# EAGLE design SENSORVALVULAF (EAGLE 9.6.2)
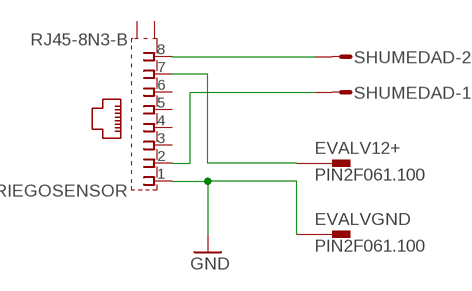
[diagram p0: schematic, sheet 1]

## Parts
EVALV12+  PIN2F061.100  [F061.100]
EVALVGND  PIN2F061.100  [F061.100]
RIEGOSENSOR  RJ45-8N3-B  [TE_RJ45-8N3-B]
SHUMEDAD  L02P  [L02P]

## Nets
GND: EVALVGND.A1 EVALVGND.A2 RIEGOSENSOR.1
N$1: RIEGOSENSOR.8 SHUMEDAD.2
N$2: RIEGOSENSOR.2 SHUMEDAD.1
N$3: EVALV12+.A1 EVALV12+.A2 RIEGOSENSOR.7
Unconnected: RIEGOSENSOR.3 RIEGOSENSOR.4 RIEGOSENSOR.5 RIEGOSENSOR.6 RIEGOSENSOR.9(S1) RIEGOSENSOR.10(S2)

## Library data of the parts
EVALV12+ EVALVGND = con-faston:PIN2: Flachstecker Typ Tyco/Electronics/AMP TAB, FASTON Printed Circuit Board Tabs Source: http://www.buerklin.com, http://catalog.tycoelectronics.com; OC_FARNELL: unknown; OC_NEWARK: unknown
RIEGOSENSOR = RJ45-8N3-B:RJ45-8N3-B: Check availability <https://pricing.snapeda.com/parts/RJ45-8N3-B/TE%20Connectivity/view-part?ref=eda>; AVAILABILITY: In Stock; CHECK_PRICES: https://www.snapeda.com/parts/RJ45-8N3-B/TE+Connectivity+Corcom+Filters/view-part/?ref=eda; COMMENT: 1-6609212-3; DESCRIPTION: FILTRO, EMI RFI, LÍNEA DE SEÑAL, RJ, CONECTOR DE 8 PINES | TE Connectivity RJ45-8N3-B; MF: TE Connectivity; MP: RJ45-8N3-B; PACKAGE: None; PRICE: None; SNAPEDA_LINK: https://www.snapeda.com/parts/RJ45-8N3-B/TE+Connectivity+Corcom+Filters/view-part/?ref=snap
SHUMEDAD = con-amp-mt:L02P: AMP MT CONNECTOR; OC_FARNELL: unknown; OC_NEWARK: unknown

## Board
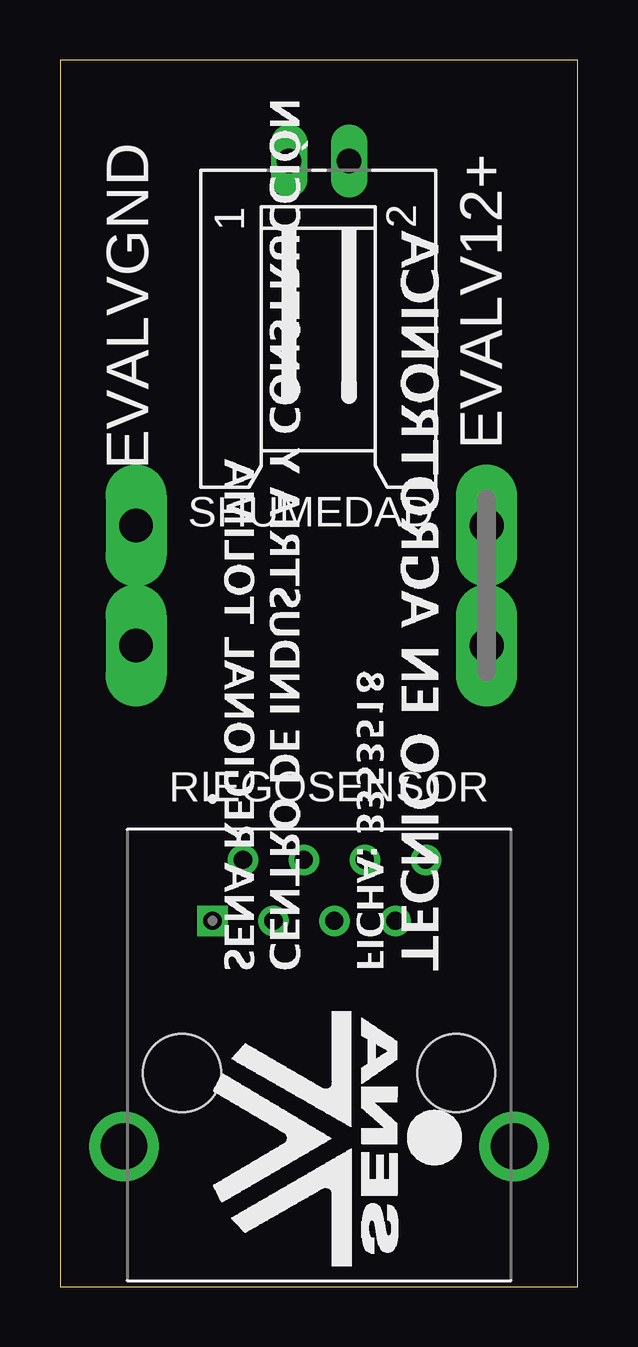
[diagram p1: board, top side]
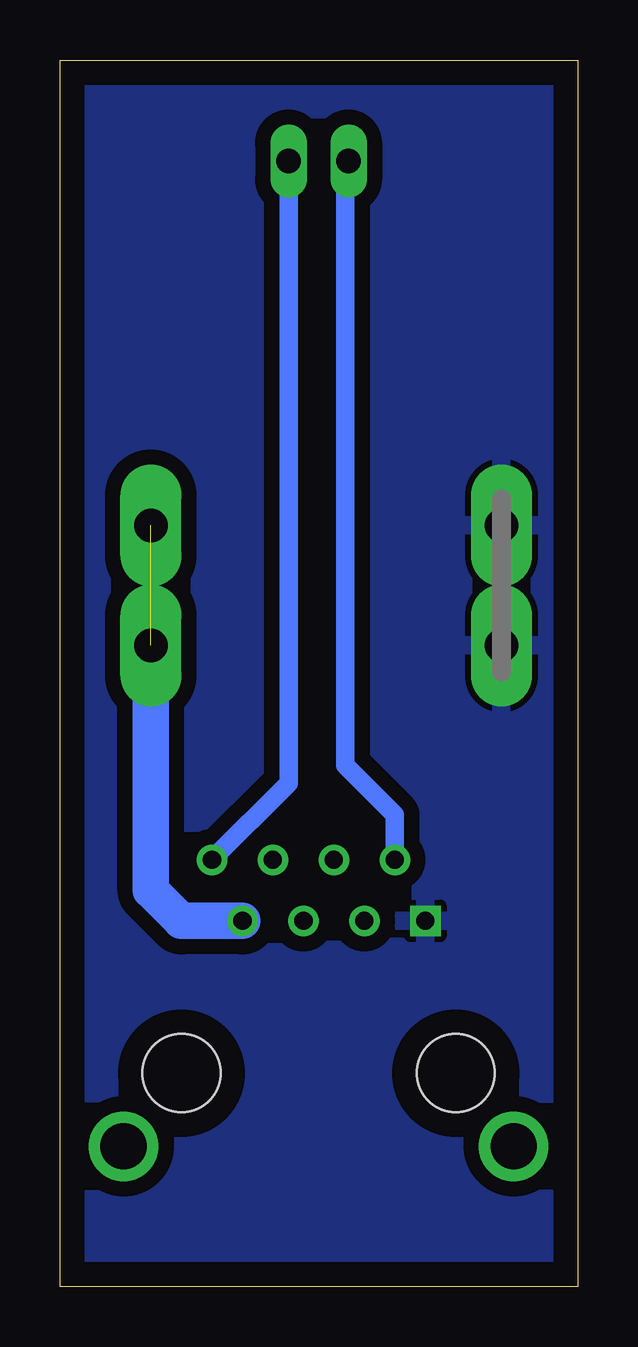
[diagram p2: board, bottom side, seen from below]

Size 21.57 x 51.11 mm. Coordinates in mm from the lower left corner, seen from the top.
Outline: 0,0 21.57,0 21.57,51.1 0,51.1 0,0
Copper layers (1*16): Top 0.035mm / dielectric 1.5mm / Bottom 0.035mm
Design rules "default": minimum track width 6mil, minimum drill 0.35mm, track to track 6mil, track to pad 6mil, pad to pad 6mil, via to via 6mil, smd to smd 6mil, copper to edge 40mil, drill to drill 6mil, minimum pad ring 10mil, minimum via ring 8mil, stop-mask expansion 4mil, vias tented up to drill 0mil, thermal gap 10mil

### Footprints (pad centres in the part's own frame; a part is rotated, then mirrored left to right if it is on the bottom)
F061.100 = drill 1.4 pad 2.54 long: A1 -2.5,0; A2 2.5,0
TE_RJ45-8N3-B = drill 0.762 square: 1 -4.445,0 | drill 0.762: 2 -3.175,2.54; 3 -1.905,0; 4 -0.635,2.54; 5 0.635,0; 7 3.175,0; 8 4.445,2.54 | drill 0.76: 6 1.905,2.54 | drill 1.93: 9 -8.128,-9.398; 10 8.128,-9.398 | hole 3.251: 5.715,-6.35; -5.715,-6.35
L02P = drill 1.016 long: 1 1.25,-6.25; 2 -1.25,-6.25

### Placement (x,y rotation side)
EVALV12+  17.78,29.21 90 top
EVALVGND  3.17,29.21 270 bottom
RIEGOSENSOR  10.8,15.24 0 top
SHUMEDAD  10.8,40.64 180 top

### Tracks (layer width: path | path; a pad name or v marks a point on that pad's centre or on a via)
GND
  pour Bottom (isolate 0.635): -2.54,53.34 -2.54,-2.54 24.77,-2.54 24.77,53.34
N$1
  Bottom 0.762: RIEGOSENSOR.8 12.04,20.97 SHUMEDAD.2
N$2
  Bottom 0.762: SHUMEDAD.1 9.68,46.75 9.68,21.72 7.62,19.65 RIEGOSENSOR.2
N$3  (1 unrouted)
  Bottom 1.524: EVALV12+.A1 17.78,16.51 16.51,15.24 RIEGOSENSOR.7